# EAGLE schematic Fonte12e5VCC (EAGLE 6.1)
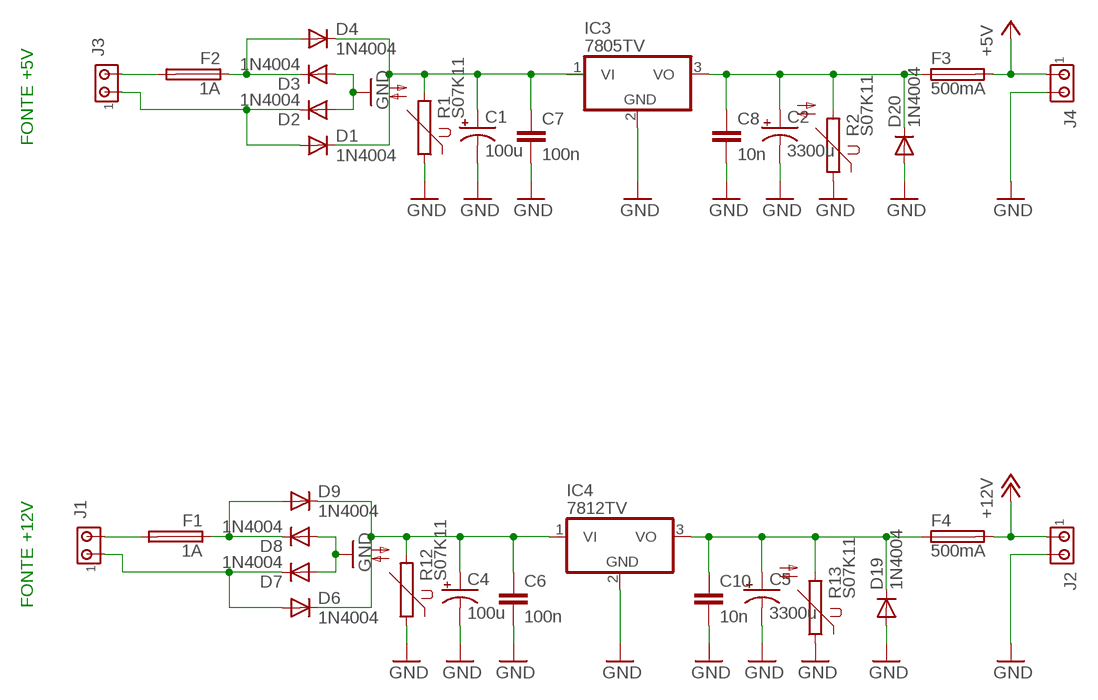
[diagram p0: schematic, sheet 1]

## Parts
C1  100u  CPOL-USE5-8.5  [E5-8,5]
C2  3300u  CPOL-USE5-8.5  [E5-8,5]
C4  100u  CPOL-USE5-8.5  [E5-8,5]
C5  3300u  CPOL-USE5-8.5  [E5-8,5]
C6  100n  C5/2.5  [C5B2.5]
C7  100n  C5/2.5  [C5B2.5]
C8  10n  C5/2.5  [C5B2.5]
C10  10n  C5/2.5  [C5B2.5]
D1  1N4004  [DO41-10]
D2  1N4004  [DO41-10]
D3  1N4004  [DO41-10]
D4  1N4004  [DO41-10]
D6  1N4004  [DO41-10]
D7  1N4004  [DO41-10]
D8  1N4004  [DO41-10]
D9  1N4004  [DO41-10]
D19  1N4004  [DO41-10]
D20  1N4004  [DO41-10]
F1  1A  GSH15  [GSH15]
F2  1A  GSH15  [GSH15]
F3  500mA  GSH15  [GSH15]
F4  500mA  GSH15  [GSH15]
IC3  7805TV  [TO220V]
IC4  7812TV  [TO220V]
J1  MTA02-156  [1X2MTA]
J2  MTA02-156  [1X2MTA]
J3  MTA02-156  [1X2MTA]
J4  MTA02-156  [1X2MTA]
R1  S07K11  [S07K11]
R2  S07K11  [S07K11]
R12  S07K11  [S07K11]
R13  S07K11  [S07K11]

## Nets
+5V: F3.2 J4.1
+12V: F4.2 J2.1
GND: C1.- C2.- C4.- C5.- C6.2 C7.2 C8.2 C10.2 D2.A D3.A D7.A D8.A D19.A D20.A IC3.2(GND) IC4.2(GND) J2.2 J4.2 R1.1 R2.1 R12.1 R13.1
N$2: F2.2 J3.2
N$3: D3.C D4.A F2.1
N$4: D1.A D2.C J3.1
N$5: C2.+ C8.1 D20.C F3.1 IC3.3(VO) R2.2
N$25: F1.2 J1.2
N$26: D8.C D9.A F1.1
N$27: D6.A D7.C J1.1
N$28: C5.+ C10.1 D19.C F4.1 IC4.3(VO) R13.2
N$29: C4.+ C6.1 D6.C D9.C IC4.1(VI) R12.2
N$37: C1.+ C7.1 D1.C D4.C IC3.1(VI) R1.2

## Notes on the sheet
- FONTE +5V
- FONTE +12V

## Library data of the parts
C1 C2 C4 C5 = resistor:CPOL-US: POLARIZED CAPACITOR, American symbol
C6-C8 C10 = capacitor-wima:C: CAPACITOR naming: grid - package width
D1-D4 D6-D9 D19 D20 = diode:1N4004: DIODE general purpose rectifier, 1 A
F1-F4 = fuse:GSH15: FUSE HOLDER grid 15mm, 19649 Wickmann; MPN: 64900001039; OC_FARNELL: 1271673; OC_NEWARK: 02P0318
IC3 IC4 = linear:78*: Positive VOLTAGE REGULATOR Source: http://cache.national.com/ds/LM/LM78L05.pdf http://www.fairchildsemi.com/ds/LM/LM7805.pdf
J1-J4 = con-amp:MTA02-156: AMP connector
R1 R2 R12 R13 = varistor:S07K11: VARISTOR